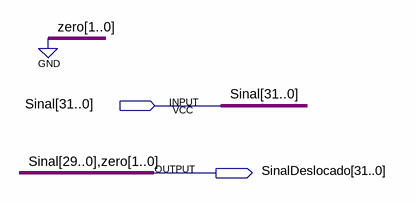
[diagram p0: schematic sheet]
// Quartus schematic DeslocaSinal.bdf as structural Verilog: 0 symbols, 2 pins
module DeslocaSinal (
  input  [31:0] Sinal,
  output [31:0] SinalDeslocado
);


  assign SinalDeslocado = {Sinal[29:0], 2'b00};
endmodule
